# EAGLE design StepperMotor-Shield-ArduinoUNO (EAGLE 9.6.1)
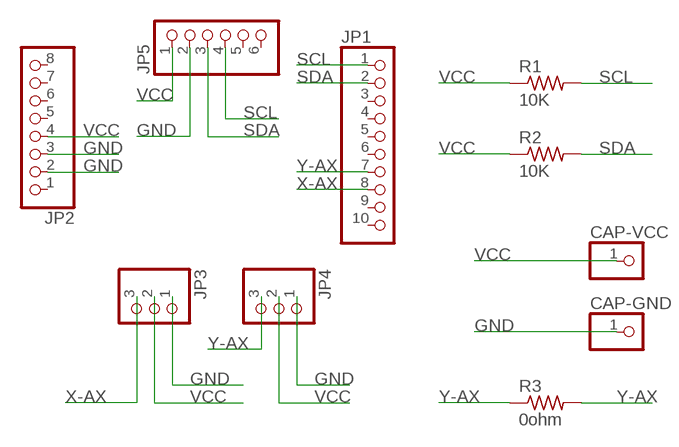
[diagram p0: schematic, sheet 1]

## Parts
CAP-GND  PINHD-1X1  [1X01]
CAP-VCC  PINHD-1X1  [1X01]
JP1  PINHD-1X10  [1X10]
JP2  PINHD-1X8  [1X08]
JP3  PINHD-1X3  [1X03]
JP4  PINHD-1X3  [1X03]
JP5  PINHD-1X6  [1X06]
R1  10K  RES-US1206FAB  [R1206FAB]
R2  10K  RES-US1206FAB  [R1206FAB]
R3  0ohm  RES-US1206FAB  [R1206FAB]

## Nets
GND: CAP-GND.1 JP2.2 JP2.3 JP3.1 JP4.1 JP5.2
SCL: JP1.1 JP5.4 R1.2
SDA: JP1.2 JP5.3 R2.2
VCC: CAP-VCC.1 JP2.4 JP3.2 JP4.2 JP5.1 R1.1 R2.1
X-AX: JP1.8 JP3.3
Y-AX: JP1.7 JP4.3 R3.1 R3.2
Unconnected: JP1.3 JP1.4 JP1.5 JP1.6 JP1.9 JP1.10 JP2.1 JP2.5 JP2.6 JP2.7 JP2.8 JP5.5 JP5.6

## Library data of the parts
CAP-GND CAP-VCC = pinhead:PINHD-1X1: PIN HEADER
JP1 = pinhead:PINHD-1X10: PIN HEADER
JP2 = pinhead:PINHD-1X8: PIN HEADER
JP3 JP4 = pinhead:PINHD-1X3: PIN HEADER
JP5 = pinhead:PINHD-1X6: PIN HEADER
R1-R3 = fab:RES-US: Resistor (US Symbol) Variants with postfix FAB are widened to allow the routing of internal traces

## Board
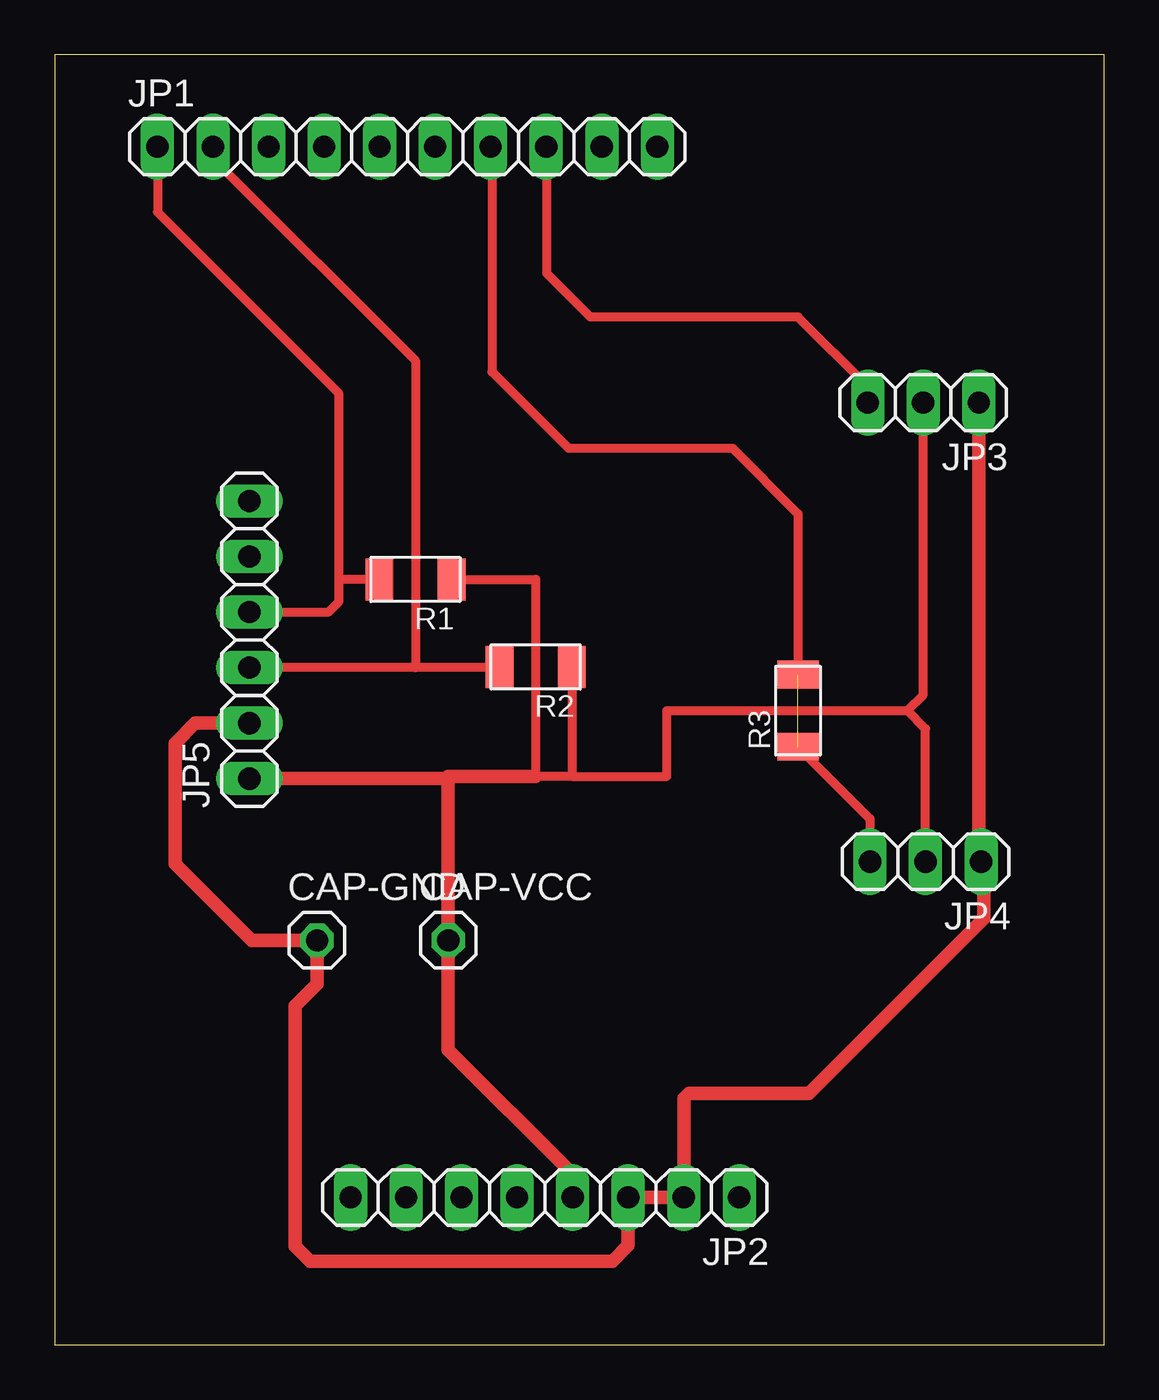
[diagram p1: board, top side]

Size 48 x 59 mm. Coordinates in mm from the lower left corner, seen from the top.
Outline: 0,0 48,0 48,59 0,59 0,0
Copper layers (1*16): Top 0.035mm / dielectric 1.5mm / Bottom 0.035mm
Design rules "default *": minimum track width 6mil, minimum drill 0.35mm, track to track 0.4mm, track to pad 0.4mm, pad to pad 0.4mm, via to via 0.4mm, smd to smd 0.4mm, copper to edge 40mil, drill to drill 6mil, minimum pad ring 10mil, minimum via ring 8mil, stop-mask expansion 4mil, vias tented up to drill 0mil, thermal gap 10mil

### Footprints (pad centres in the part's own frame; a part is rotated, then mirrored left to right if it is on the bottom)
1X01 = drill 1.016 octagon: 1 0,0
1X10 = drill 1.016 long: 1 -11.43,0; 2 -8.89,0; 3 -6.35,0; 4 -3.81,0; 5 -1.27,0; 6 1.27,0; 7 3.81,0; 8 6.35,0; 9 8.89,0; 10 11.43,0
1X08 = drill 1.016 long: 1 -8.89,0; 2 -6.35,0; 3 -3.81,0; 4 -1.27,0; 5 1.27,0; 6 3.81,0; 7 6.35,0; 8 8.89,0
1X03 = drill 1.016 long: 1 -2.54,0; 2 0,0; 3 2.54,0
1X06 = drill 1.016 long: 1 -6.35,0; 2 -3.81,0; 3 -1.27,0; 4 1.27,0; 5 3.81,0; 6 6.35,0
R1206FAB = smd 1.27 x 1.905: 1 -1.651,0; 2 1.651,0

### Placement (x,y rotation side)
CAP-GND  12,18.5 0 top
CAP-VCC  18,18.5 0 top
JP1  16.13,54.79 0 top
JP2  22.42,6.74 180 top
JP3  39.72,43.09 180 top
JP4  39.83,22.09 180 top
JP5  8.91,32.24 90 top
R1  16.5,35 180 top
R2  22,31 180 top
R3  34,29 90 top

### Tracks (layer width: path | path; a pad name or v marks a point on that pad's centre or on a via)
GND
  Top 0.61: JP5.2 6.43,28.43 5.5,27.5 5.5,22 9,18.5 CAP-GND.1 12,16.5 11,15.5 11,4.5 11.68,3.82 25.5,3.82 26.23,4.55 JP2.3 JP2.2 28.77,11.27 29,11.5 34.5,11.5 42.5,19.5 42.5,21.96 JP4.1 42.26,22.2 JP3.1
SCL
  Top 0.406: JP1.1 4.7,51.8 13,43.5 13,35 | JP5.4 12.49,33.51 12.5,33.5 13,34 13,35 | R1.2 13,35
SDA
  Top 0.406: JP1.2 7.5,54.53 7.5,54 16.5,45 16.5,30.97 | 16.5,30.97 20.32,30.97 R2.2 | 16.5,30.97 JP5.3
VCC
  Top 0.406: 39,29 39.72,29.72 JP3.2 | JP4.2 39.83,28.17 39,29 | R1.1 22,35 22,26 23.65,26 | R2.1 23.65,26 | 23.65,26 28,26 28,29 39,29
  Top 0.61: JP2.4 23.69,7.81 18,13.5 CAP-VCC.1 18,25.89 | JP5.1 18,25.89 | 18,25.89 18,26 22,26
X-AX
  Top 0.406: JP1.8 22.5,54.77 22.5,49 24.5,47 34,47 37.18,43.82 JP3.3
Y-AX  (1 unrouted)
  Top 0.406: JP1.7 20,54.73 20,44.5 23.5,41 31,41 34,38 R3.2 | R3.1 37.29,24.06 JP4.3